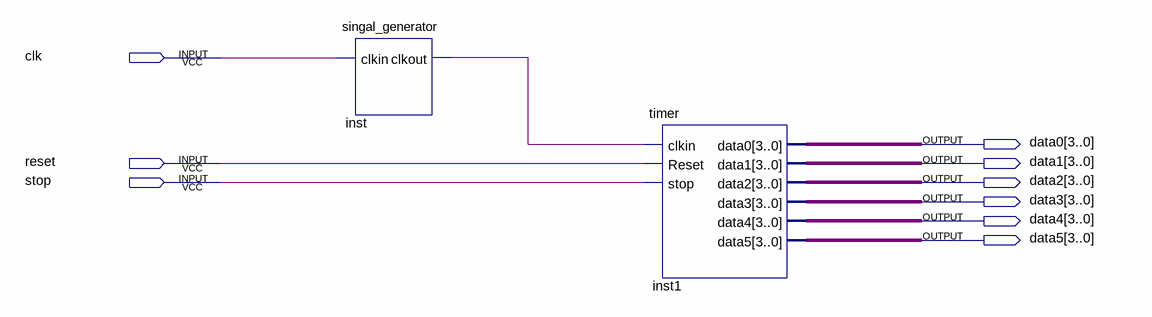
[diagram p0: schematic sheet]
// Quartus schematic clock.bdf as structural Verilog: 2 symbols, 9 pins
module clock (
  input  clk,
  input  reset,
  input  stop,
  output [3:0] data0,
  output [3:0] data1,
  output [3:0] data2,
  output [3:0] data3,
  output [3:0] data4,
  output [3:0] data5
);

  wire inst_clkout;

  singal_generator inst (.clkin(clk), .clkout(inst_clkout));
  timer inst1 (
    .clkin(inst_clkout), .Reset(reset), .stop(stop), .data0(data0), .data1(data1), .data2(data2),
    .data3(data3), .data4(data4), .data5(data5));
endmodule
